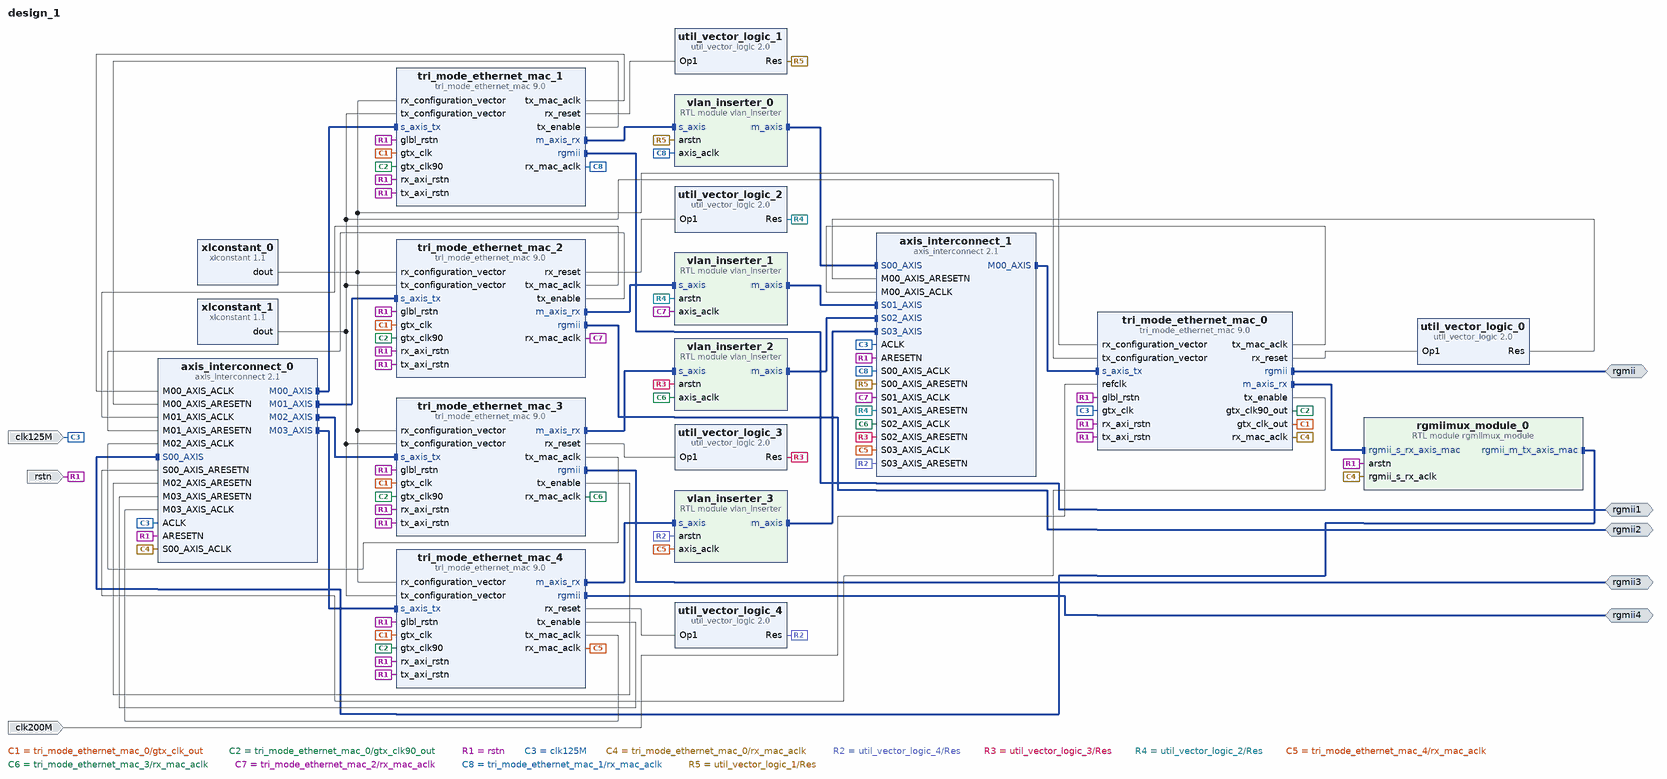
[diagram p0: block diagram of the top level]
# Vivado block design design_1, xc7z020clg484-2, Vivado 2018.1
create_bd_design design_1

create_bd_intf_port -mode Master -vlnv xilinx.com:interface:rgmii_rtl:1.0 rgmii
create_bd_intf_port -mode Master -vlnv xilinx.com:interface:rgmii_rtl:1.0 rgmii1
create_bd_intf_port -mode Master -vlnv xilinx.com:interface:rgmii_rtl:1.0 rgmii2
create_bd_intf_port -mode Master -vlnv xilinx.com:interface:rgmii_rtl:1.0 rgmii3
create_bd_intf_port -mode Master -vlnv xilinx.com:interface:rgmii_rtl:1.0 rgmii4
create_bd_port -dir I -type rst rstn
create_bd_port -dir I -type clk clk200M
set_property -dict {CONFIG.FREQ_HZ 200000000} [get_bd_ports clk200M]
create_bd_port -dir I -type clk clk125M
set_property -dict {CONFIG.FREQ_HZ 125000000 CONFIG.PHASE 0} [get_bd_ports clk125M]

create_bd_cell -type ip -vlnv xilinx.com:ip:tri_mode_ethernet_mac:9.0 tri_mode_ethernet_mac_0
set_property -dict [list \
  CONFIG.Physical_Interface RGMII \
  CONFIG.MAC_Speed Tri_speed \
  CONFIG.Management_Interface false \
  CONFIG.Frame_Filter false \
  CONFIG.SupportLevel 1 \
] [get_bd_cells tri_mode_ethernet_mac_0]
create_bd_cell -type ip -vlnv xilinx.com:ip:tri_mode_ethernet_mac:9.0 tri_mode_ethernet_mac_1
set_property -dict [list \
  CONFIG.Physical_Interface RGMII \
  CONFIG.MAC_Speed Tri_speed \
  CONFIG.Management_Interface false \
  CONFIG.Frame_Filter false \
] [get_bd_cells tri_mode_ethernet_mac_1]
create_bd_cell -type ip -vlnv xilinx.com:ip:tri_mode_ethernet_mac:9.0 tri_mode_ethernet_mac_2
set_property -dict [list \
  CONFIG.Physical_Interface RGMII \
  CONFIG.MAC_Speed Tri_speed \
  CONFIG.Management_Interface false \
  CONFIG.Frame_Filter false \
] [get_bd_cells tri_mode_ethernet_mac_2]
create_bd_cell -type ip -vlnv xilinx.com:ip:tri_mode_ethernet_mac:9.0 tri_mode_ethernet_mac_3
set_property -dict [list \
  CONFIG.Physical_Interface RGMII \
  CONFIG.MAC_Speed Tri_speed \
  CONFIG.Management_Interface false \
  CONFIG.Frame_Filter false \
] [get_bd_cells tri_mode_ethernet_mac_3]
create_bd_cell -type ip -vlnv xilinx.com:ip:tri_mode_ethernet_mac:9.0 tri_mode_ethernet_mac_4
set_property -dict [list \
  CONFIG.Physical_Interface RGMII \
  CONFIG.MAC_Speed Tri_speed \
  CONFIG.Management_Interface false \
  CONFIG.Frame_Filter false \
] [get_bd_cells tri_mode_ethernet_mac_4]
create_bd_cell -type ip -vlnv xilinx.com:ip:xlconstant:1.1 xlconstant_0
set_property -dict {CONFIG.CONST_WIDTH 80 CONFIG.CONST_VAL 10286} [get_bd_cells xlconstant_0]
create_bd_cell -type ip -vlnv xilinx.com:ip:xlconstant:1.1 xlconstant_1
set_property -dict {CONFIG.CONST_WIDTH 80 CONFIG.CONST_VAL 8206} [get_bd_cells xlconstant_1]
create_bd_cell -type ip -vlnv xilinx.com:ip:axis_interconnect:2.1 axis_interconnect_0
set_property -dict [list \
  CONFIG.NUM_MI 4 \
  CONFIG.ENABLE_ADVANCED_OPTIONS 0 \
  CONFIG.ARB_ON_TLAST 1 \
  CONFIG.M00_HAS_REGSLICE 1 \
  CONFIG.M01_HAS_REGSLICE 1 \
  CONFIG.M02_HAS_REGSLICE 1 \
  CONFIG.M03_HAS_REGSLICE 1 \
  CONFIG.M00_FIFO_DEPTH 2048 \
  CONFIG.M01_FIFO_DEPTH 2048 \
  CONFIG.M02_FIFO_DEPTH 2048 \
  CONFIG.M03_FIFO_DEPTH 2048 \
  CONFIG.M00_FIFO_MODE 0 \
  CONFIG.M01_FIFO_MODE 0 \
  CONFIG.M02_FIFO_MODE 0 \
  CONFIG.M03_FIFO_MODE 0 \
  CONFIG.S00_HAS_REGSLICE 1 \
  CONFIG.S00_FIFO_DEPTH 2048 \
  CONFIG.S00_FIFO_MODE 0 \
  CONFIG.M00_AXIS_BASETDEST 0x00000001 \
  CONFIG.M01_AXIS_BASETDEST 0x00000002 \
  CONFIG.M02_AXIS_BASETDEST 0x00000003 \
  CONFIG.M03_AXIS_BASETDEST 0x00000004 \
  CONFIG.M00_AXIS_HIGHTDEST 0x00000001 \
  CONFIG.M01_AXIS_HIGHTDEST 0x00000002 \
  CONFIG.M02_AXIS_HIGHTDEST 0x00000003 \
  CONFIG.M03_AXIS_HIGHTDEST 0x00000004 \
] [get_bd_cells axis_interconnect_0]
create_bd_cell -type ip -vlnv xilinx.com:ip:axis_interconnect:2.1 axis_interconnect_1
set_property -dict [list \
  CONFIG.NUM_SI 4 \
  CONFIG.NUM_MI 1 \
  CONFIG.ENABLE_ADVANCED_OPTIONS 0 \
  CONFIG.ENABLE_FIFO_COUNT_PORTS 0 \
  CONFIG.ARB_ON_TLAST 0 \
  CONFIG.M00_HAS_REGSLICE 1 \
  CONFIG.M00_FIFO_DEPTH 2048 \
  CONFIG.M00_FIFO_MODE 1 \
  CONFIG.S00_HAS_REGSLICE 1 \
  CONFIG.S01_HAS_REGSLICE 1 \
  CONFIG.S02_HAS_REGSLICE 1 \
  CONFIG.S03_HAS_REGSLICE 1 \
  CONFIG.S00_FIFO_DEPTH 2048 \
  CONFIG.S01_FIFO_DEPTH 2048 \
  CONFIG.S02_FIFO_DEPTH 2048 \
  CONFIG.S03_FIFO_DEPTH 2048 \
  CONFIG.S00_FIFO_MODE 1 \
  CONFIG.S01_FIFO_MODE 1 \
  CONFIG.S02_FIFO_MODE 1 \
  CONFIG.S03_FIFO_MODE 1 \
] [get_bd_cells axis_interconnect_1]
create_bd_cell -type ip -vlnv xilinx.com:ip:util_vector_logic:2.0 util_vector_logic_2
set_property -dict {CONFIG.C_SIZE 1 CONFIG.C_OPERATION not} [get_bd_cells util_vector_logic_2]
create_bd_cell -type ip -vlnv xilinx.com:ip:util_vector_logic:2.0 util_vector_logic_3
set_property -dict {CONFIG.C_SIZE 1 CONFIG.C_OPERATION not} [get_bd_cells util_vector_logic_3]
create_bd_cell -type ip -vlnv xilinx.com:ip:util_vector_logic:2.0 util_vector_logic_4
set_property -dict {CONFIG.C_SIZE 1 CONFIG.C_OPERATION not} [get_bd_cells util_vector_logic_4]
create_bd_cell -type ip -vlnv xilinx.com:ip:util_vector_logic:2.0 util_vector_logic_0
set_property -dict {CONFIG.C_SIZE 1 CONFIG.C_OPERATION not} [get_bd_cells util_vector_logic_0]
create_bd_cell -type ip -vlnv xilinx.com:ip:util_vector_logic:2.0 util_vector_logic_1
set_property -dict {CONFIG.C_SIZE 1 CONFIG.C_OPERATION not} [get_bd_cells util_vector_logic_1]
create_bd_cell -type module -reference rgmiimux_module rgmiimux_module_0
create_bd_cell -type module -reference vlan_inserter vlan_inserter_0
set_property -dict {CONFIG.VLAN_IDENTIFIER 1} [get_bd_cells vlan_inserter_0]
create_bd_cell -type module -reference vlan_inserter vlan_inserter_1
set_property -dict {CONFIG.VLAN_IDENTIFIER 1} [get_bd_cells vlan_inserter_1]
create_bd_cell -type module -reference vlan_inserter vlan_inserter_2
set_property -dict {CONFIG.VLAN_IDENTIFIER 1} [get_bd_cells vlan_inserter_2]
create_bd_cell -type module -reference vlan_inserter vlan_inserter_3
set_property -dict {CONFIG.VLAN_IDENTIFIER 1} [get_bd_cells vlan_inserter_3]

# ---- connections ----

connect_bd_intf_net [get_bd_intf_pins axis_interconnect_0/M00_AXIS] [get_bd_intf_pins tri_mode_ethernet_mac_1/s_axis_tx]
connect_bd_intf_net [get_bd_intf_pins tri_mode_ethernet_mac_0/m_axis_rx] [get_bd_intf_pins rgmiimux_module_0/rgmii_s_rx_axis_mac]
connect_bd_intf_net [get_bd_intf_pins rgmiimux_module_0/rgmii_m_tx_axis_mac] [get_bd_intf_pins axis_interconnect_0/S00_AXIS]
connect_bd_intf_net [get_bd_intf_pins axis_interconnect_0/M01_AXIS] [get_bd_intf_pins tri_mode_ethernet_mac_2/s_axis_tx]
connect_bd_intf_net [get_bd_intf_pins axis_interconnect_0/M02_AXIS] [get_bd_intf_pins tri_mode_ethernet_mac_3/s_axis_tx]
connect_bd_intf_net [get_bd_intf_pins axis_interconnect_0/M03_AXIS] [get_bd_intf_pins tri_mode_ethernet_mac_4/s_axis_tx]
connect_bd_intf_net [get_bd_intf_pins tri_mode_ethernet_mac_1/m_axis_rx] [get_bd_intf_pins vlan_inserter_0/s_axis]
connect_bd_intf_net [get_bd_intf_pins vlan_inserter_0/m_axis] [get_bd_intf_pins axis_interconnect_1/S00_AXIS]
connect_bd_intf_net [get_bd_intf_pins axis_interconnect_1/M00_AXIS] [get_bd_intf_pins tri_mode_ethernet_mac_0/s_axis_tx]
connect_bd_intf_net [get_bd_intf_pins tri_mode_ethernet_mac_2/m_axis_rx] [get_bd_intf_pins vlan_inserter_1/s_axis]
connect_bd_intf_net [get_bd_intf_pins vlan_inserter_1/m_axis] [get_bd_intf_pins axis_interconnect_1/S01_AXIS]
connect_bd_intf_net [get_bd_intf_pins tri_mode_ethernet_mac_3/m_axis_rx] [get_bd_intf_pins vlan_inserter_2/s_axis]
connect_bd_intf_net [get_bd_intf_pins vlan_inserter_2/m_axis] [get_bd_intf_pins axis_interconnect_1/S02_AXIS]
connect_bd_intf_net [get_bd_intf_pins tri_mode_ethernet_mac_4/m_axis_rx] [get_bd_intf_pins vlan_inserter_3/s_axis]
connect_bd_intf_net [get_bd_intf_pins vlan_inserter_3/m_axis] [get_bd_intf_pins axis_interconnect_1/S03_AXIS]
connect_bd_intf_net [get_bd_intf_ports rgmii] [get_bd_intf_pins tri_mode_ethernet_mac_0/rgmii]
connect_bd_intf_net [get_bd_intf_ports rgmii1] [get_bd_intf_pins tri_mode_ethernet_mac_1/rgmii]
connect_bd_intf_net [get_bd_intf_ports rgmii2] [get_bd_intf_pins tri_mode_ethernet_mac_2/rgmii]
connect_bd_intf_net [get_bd_intf_ports rgmii3] [get_bd_intf_pins tri_mode_ethernet_mac_3/rgmii]
connect_bd_intf_net [get_bd_intf_ports rgmii4] [get_bd_intf_pins tri_mode_ethernet_mac_4/rgmii]
connect_bd_net [get_bd_pins tri_mode_ethernet_mac_0/gtx_clk_out] \
  [get_bd_pins tri_mode_ethernet_mac_1/gtx_clk] [get_bd_pins tri_mode_ethernet_mac_2/gtx_clk] \
  [get_bd_pins tri_mode_ethernet_mac_3/gtx_clk] [get_bd_pins tri_mode_ethernet_mac_4/gtx_clk]
connect_bd_net [get_bd_pins tri_mode_ethernet_mac_0/gtx_clk90_out] \
  [get_bd_pins tri_mode_ethernet_mac_1/gtx_clk90] [get_bd_pins tri_mode_ethernet_mac_3/gtx_clk90] \
  [get_bd_pins tri_mode_ethernet_mac_4/gtx_clk90] [get_bd_pins tri_mode_ethernet_mac_2/gtx_clk90]
connect_bd_net -net glbl_rstn_0_1 [get_bd_ports rstn] \
  [get_bd_pins tri_mode_ethernet_mac_0/glbl_rstn] [get_bd_pins tri_mode_ethernet_mac_1/glbl_rstn] \
  [get_bd_pins tri_mode_ethernet_mac_4/glbl_rstn] [get_bd_pins tri_mode_ethernet_mac_2/glbl_rstn] \
  [get_bd_pins tri_mode_ethernet_mac_0/rx_axi_rstn] [get_bd_pins tri_mode_ethernet_mac_0/tx_axi_rstn] \
  [get_bd_pins tri_mode_ethernet_mac_1/rx_axi_rstn] [get_bd_pins tri_mode_ethernet_mac_1/tx_axi_rstn] \
  [get_bd_pins tri_mode_ethernet_mac_2/rx_axi_rstn] [get_bd_pins tri_mode_ethernet_mac_2/tx_axi_rstn] \
  [get_bd_pins tri_mode_ethernet_mac_4/rx_axi_rstn] [get_bd_pins tri_mode_ethernet_mac_4/tx_axi_rstn] \
  [get_bd_pins tri_mode_ethernet_mac_3/glbl_rstn] [get_bd_pins tri_mode_ethernet_mac_3/tx_axi_rstn] \
  [get_bd_pins tri_mode_ethernet_mac_3/rx_axi_rstn] [get_bd_pins axis_interconnect_0/ARESETN] \
  [get_bd_pins axis_interconnect_1/ARESETN] [get_bd_pins rgmiimux_module_0/arstn]
connect_bd_net -net refclk_0_1 [get_bd_ports clk200M] [get_bd_pins tri_mode_ethernet_mac_0/refclk]
connect_bd_net -net gtx_clk_0_1 [get_bd_ports clk125M] \
  [get_bd_pins tri_mode_ethernet_mac_0/gtx_clk] [get_bd_pins axis_interconnect_0/ACLK] [get_bd_pins axis_interconnect_1/ACLK]
connect_bd_net [get_bd_pins xlconstant_0/dout] \
  [get_bd_pins tri_mode_ethernet_mac_0/rx_configuration_vector] [get_bd_pins tri_mode_ethernet_mac_2/rx_configuration_vector] \
  [get_bd_pins tri_mode_ethernet_mac_3/rx_configuration_vector] [get_bd_pins tri_mode_ethernet_mac_4/rx_configuration_vector] \
  [get_bd_pins tri_mode_ethernet_mac_1/rx_configuration_vector]
connect_bd_net [get_bd_pins xlconstant_1/dout] \
  [get_bd_pins tri_mode_ethernet_mac_0/tx_configuration_vector] [get_bd_pins tri_mode_ethernet_mac_2/tx_configuration_vector] \
  [get_bd_pins tri_mode_ethernet_mac_3/tx_configuration_vector] [get_bd_pins tri_mode_ethernet_mac_4/tx_configuration_vector] \
  [get_bd_pins tri_mode_ethernet_mac_1/tx_configuration_vector]
connect_bd_net -net S00_AXIS_ACLK_1 [get_bd_pins tri_mode_ethernet_mac_0/rx_mac_aclk] \
  [get_bd_pins axis_interconnect_0/S00_AXIS_ACLK] [get_bd_pins rgmiimux_module_0/rgmii_s_rx_aclk]
connect_bd_net [get_bd_pins tri_mode_ethernet_mac_0/tx_enable] [get_bd_pins axis_interconnect_0/S00_AXIS_ARESETN]
connect_bd_net -net M00_AXIS_ACLK_1 [get_bd_pins tri_mode_ethernet_mac_1/tx_mac_aclk] [get_bd_pins axis_interconnect_0/M00_AXIS_ACLK]
connect_bd_net -net M01_AXIS_ACLK_1 [get_bd_pins tri_mode_ethernet_mac_2/tx_mac_aclk] [get_bd_pins axis_interconnect_0/M01_AXIS_ACLK]
connect_bd_net [get_bd_pins tri_mode_ethernet_mac_2/tx_enable] [get_bd_pins axis_interconnect_0/M01_AXIS_ARESETN]
connect_bd_net -net M02_AXIS_ACLK_1 [get_bd_pins tri_mode_ethernet_mac_3/tx_mac_aclk] [get_bd_pins axis_interconnect_0/M02_AXIS_ACLK]
connect_bd_net [get_bd_pins tri_mode_ethernet_mac_1/tx_enable] [get_bd_pins axis_interconnect_0/M00_AXIS_ARESETN]
connect_bd_net [get_bd_pins tri_mode_ethernet_mac_3/tx_enable] [get_bd_pins axis_interconnect_0/M02_AXIS_ARESETN]
connect_bd_net [get_bd_pins tri_mode_ethernet_mac_4/tx_enable] [get_bd_pins axis_interconnect_0/M03_AXIS_ARESETN]
connect_bd_net -net M03_AXIS_ACLK_1 [get_bd_pins tri_mode_ethernet_mac_4/tx_mac_aclk] [get_bd_pins axis_interconnect_0/M03_AXIS_ACLK]
connect_bd_net [get_bd_pins util_vector_logic_4/Res] [get_bd_pins axis_interconnect_1/S03_AXIS_ARESETN] [get_bd_pins vlan_inserter_3/arstn]
connect_bd_net [get_bd_pins util_vector_logic_3/Res] [get_bd_pins axis_interconnect_1/S02_AXIS_ARESETN] [get_bd_pins vlan_inserter_2/arstn]
connect_bd_net [get_bd_pins util_vector_logic_2/Res] [get_bd_pins axis_interconnect_1/S01_AXIS_ARESETN] [get_bd_pins vlan_inserter_1/arstn]
connect_bd_net [get_bd_pins tri_mode_ethernet_mac_4/rx_mac_aclk] \
  [get_bd_pins axis_interconnect_1/S03_AXIS_ACLK] [get_bd_pins vlan_inserter_3/axis_aclk]
connect_bd_net [get_bd_pins tri_mode_ethernet_mac_3/rx_mac_aclk] \
  [get_bd_pins axis_interconnect_1/S02_AXIS_ACLK] [get_bd_pins vlan_inserter_2/axis_aclk]
connect_bd_net [get_bd_pins tri_mode_ethernet_mac_2/rx_mac_aclk] \
  [get_bd_pins axis_interconnect_1/S01_AXIS_ACLK] [get_bd_pins vlan_inserter_1/axis_aclk]
connect_bd_net [get_bd_pins tri_mode_ethernet_mac_1/rx_mac_aclk] \
  [get_bd_pins axis_interconnect_1/S00_AXIS_ACLK] [get_bd_pins vlan_inserter_0/axis_aclk]
connect_bd_net [get_bd_pins tri_mode_ethernet_mac_0/tx_mac_aclk] [get_bd_pins axis_interconnect_1/M00_AXIS_ACLK]
connect_bd_net [get_bd_pins util_vector_logic_1/Res] [get_bd_pins axis_interconnect_1/S00_AXIS_ARESETN] [get_bd_pins vlan_inserter_0/arstn]
connect_bd_net [get_bd_pins util_vector_logic_0/Res] [get_bd_pins axis_interconnect_1/M00_AXIS_ARESETN]
connect_bd_net [get_bd_pins tri_mode_ethernet_mac_0/rx_reset] [get_bd_pins util_vector_logic_0/Op1]
connect_bd_net [get_bd_pins tri_mode_ethernet_mac_1/rx_reset] [get_bd_pins util_vector_logic_1/Op1]
connect_bd_net [get_bd_pins tri_mode_ethernet_mac_2/rx_reset] [get_bd_pins util_vector_logic_2/Op1]
connect_bd_net [get_bd_pins tri_mode_ethernet_mac_4/rx_reset] [get_bd_pins util_vector_logic_4/Op1]
connect_bd_net [get_bd_pins tri_mode_ethernet_mac_3/rx_reset] [get_bd_pins util_vector_logic_3/Op1]

validate_bd_design
save_bd_design
